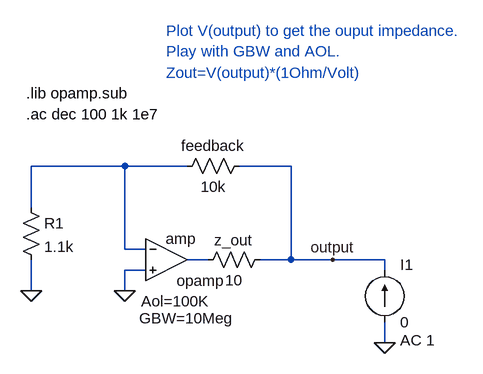
[diagram p0: schematic opamp_rout.asc]
opamp_rout.asc, the LTspice schematic file:
Version 4
SHEET 1 880 680
WIRE 16 80 -128 80
WIRE 112 80 16 80
WIRE 272 80 192 80
WIRE -128 144 -128 80
WIRE 16 208 16 80
WIRE 48 208 16 208
WIRE 144 224 112 224
WIRE 272 224 272 80
WIRE 272 224 224 224
WIRE 336 224 272 224
WIRE 416 224 336 224
WIRE 48 240 16 240
WIRE 416 240 416 224
WIRE -128 272 -128 224
WIRE 16 272 16 240
WIRE 416 352 416 320
FLAG 16 272 0
FLAG -128 272 0
FLAG 336 224 output
FLAG 416 352 0
SYMBOL Opamps\\opamp 80 160 R0
WINDOW 0 23 32 Center 0
WINDOW 39 14 128 Center 0
WINDOW 40 31 154 Center 0
SYMATTR InstName amp
SYMBOL res -144 128 R0
SYMATTR InstName R1
SYMATTR Value 1.1k
SYMBOL res 208 64 R90
WINDOW 0 0 56 VBottom 0
WINDOW 3 32 56 VTop 0
SYMATTR InstName feedback
SYMATTR Value 10k
SYMBOL res 240 208 R90
WINDOW 0 -14 27 VRight 0
WINDOW 3 32 56 VTop 0
SYMATTR InstName z_out
SYMATTR Value 10
SYMBOL current 416 320 M180
WINDOW 0 24 88 Left 0
WINDOW 3 24 0 Left 0
WINDOW 123 24 -28 Left 0
WINDOW 39 0 0 Left 0
SYMATTR InstName I1
SYMATTR Value 0
SYMATTR Value2 AC 1
TEXT -136 -32 Left 0 !.lib opamp.sub
TEXT -136 0 Left 0 !.ac dec 100 1k 1e7
TEXT 80 -64 Left 0 ;Zout=V(output)*(1Ohm/Volt)
TEXT 80 -128 Left 0 ;Plot V(output) to get the ouput impedance.\nPlay with GBW and AOL.

The netlist it stands for:
* opamp_rout.asc
Xamp N001 0 N002 opamp Aol=100K GBW=10Meg  ; pins invin noninvin out
R1 N001 0 1.1k
R§feedback output N001 10k
R§z_out output N002 10
I1 0 output 0 AC 1
.lib opamp.sub
.ac dec 100 1k 1e7
* Zout=V(output)*(1Ohm/Volt)
* Plot V(output) to get the ouput impedance.
* Play with GBW and AOL.
.backanno
.end